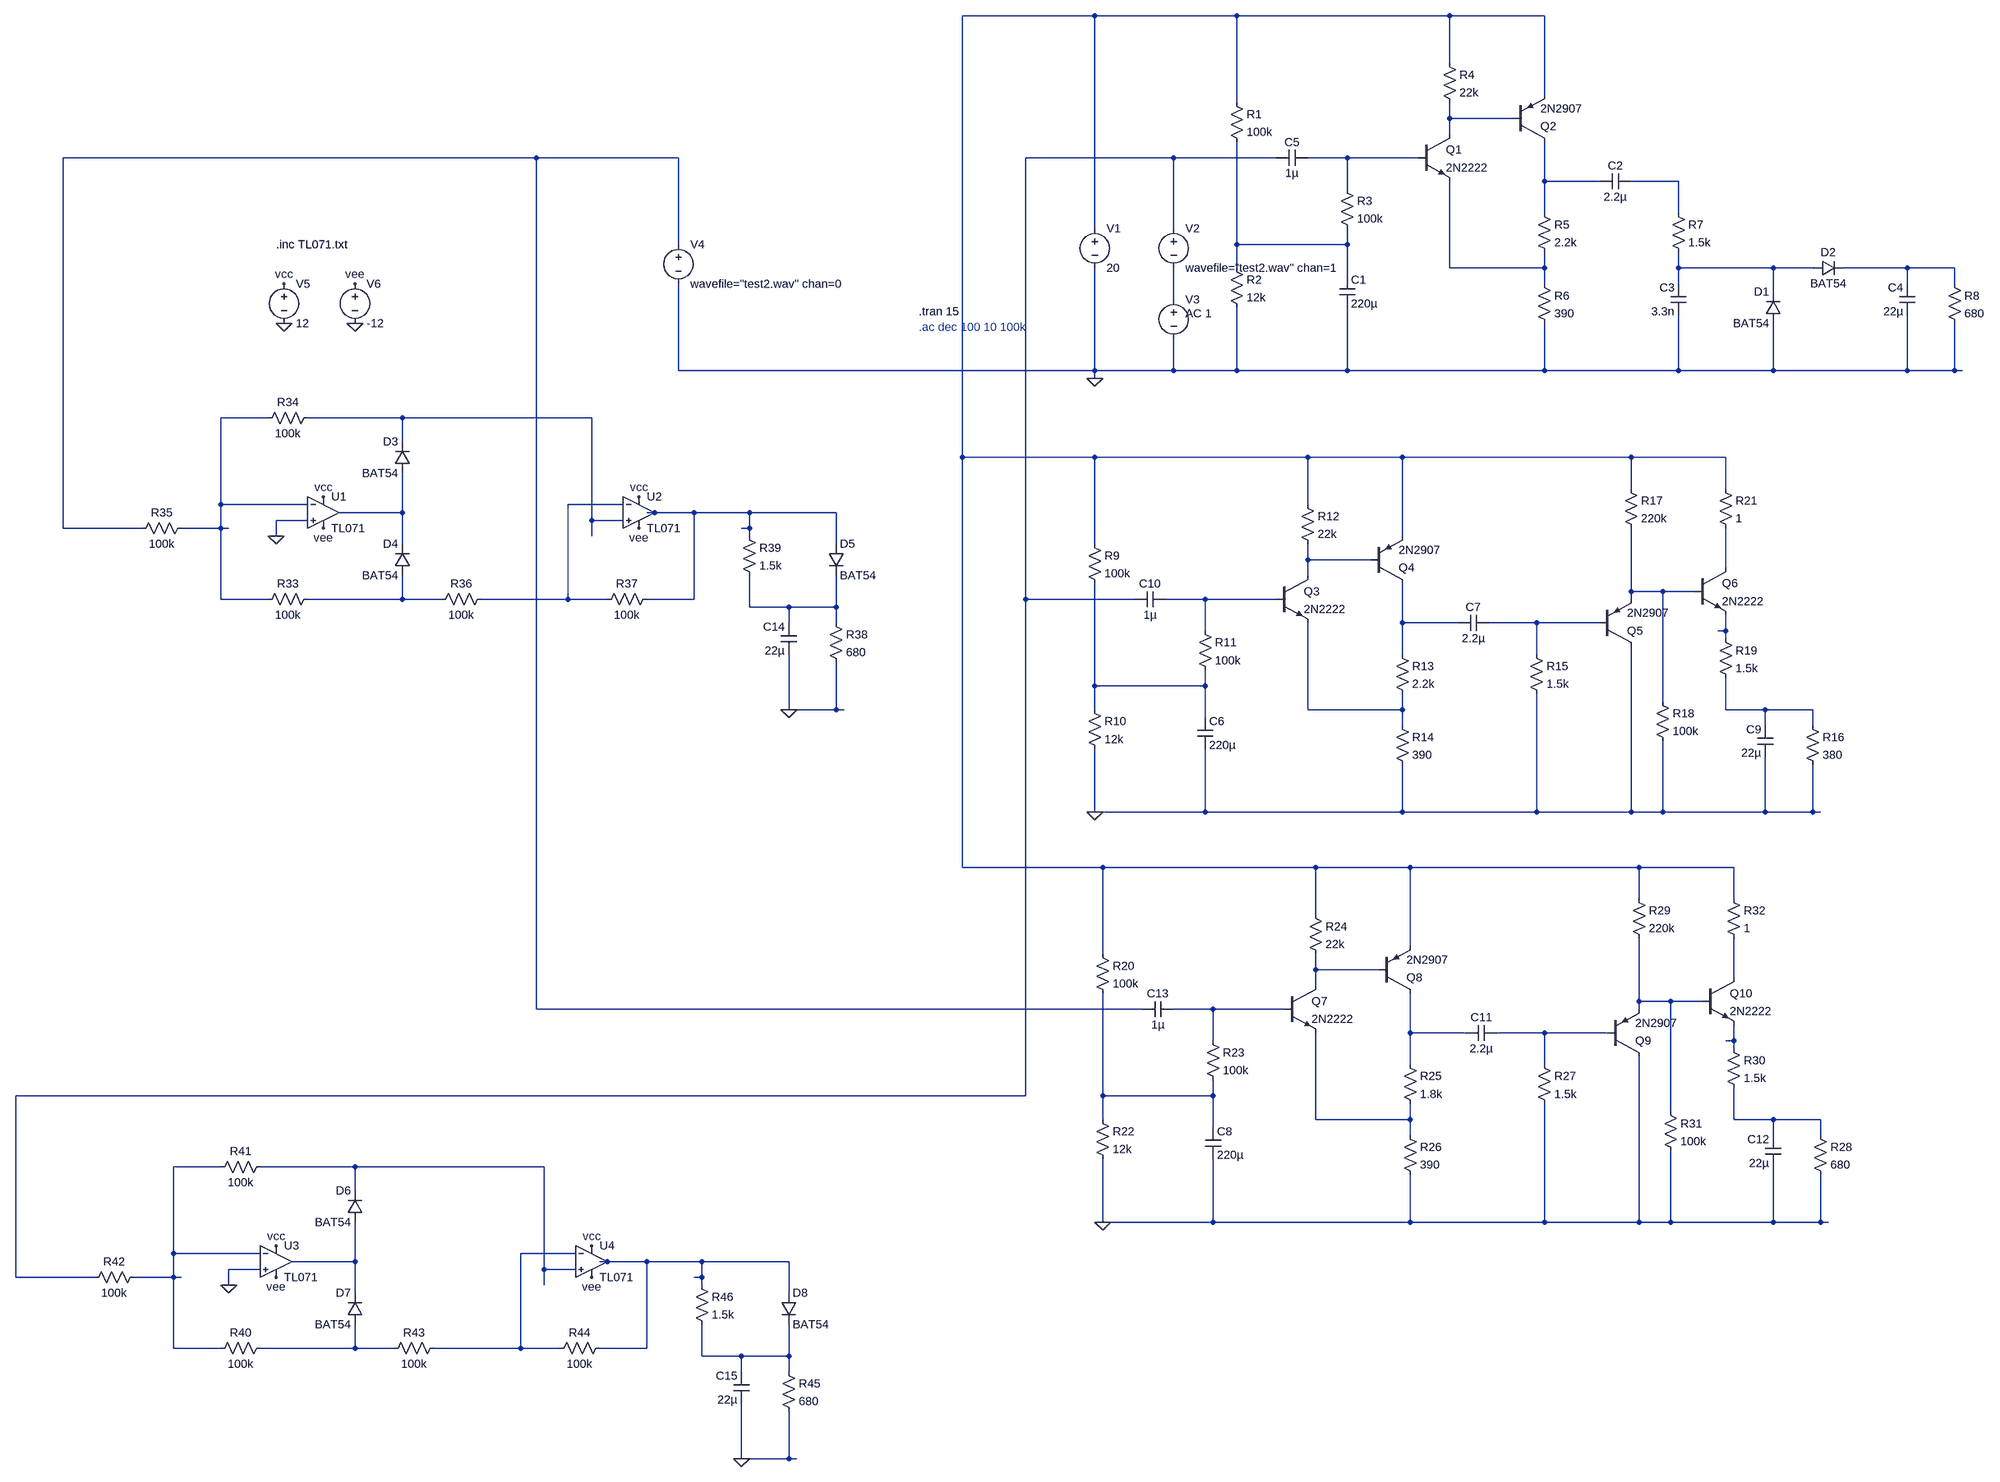
[diagram p0: schematic vumeter.asc]
vumeter.asc, the LTspice schematic file:
Version 4.1
SHEET 1 4276 2852
WIRE -192 -96 -464 -96
WIRE 96 -96 -192 -96
WIRE 528 -96 96 -96
WIRE 720 -96 528 -96
WIRE 528 0 528 -96
WIRE 720 64 720 -96
WIRE 96 80 96 -96
WIRE 528 112 528 80
WIRE 656 112 528 112
WIRE 528 144 528 112
WIRE -1328 192 -2288 192
WIRE -1040 192 -1328 192
WIRE -32 192 -336 192
WIRE 176 192 -32 192
WIRE 320 192 240 192
WIRE 464 192 320 192
WIRE 720 240 720 160
WIRE 832 240 720 240
WIRE 992 240 896 240
WIRE 320 256 320 192
WIRE 720 304 720 240
WIRE 992 304 992 240
WIRE -192 336 -192 -96
WIRE -32 336 -32 192
WIRE -1040 368 -1040 192
WIRE 96 368 96 160
WIRE 320 368 320 336
WIRE 320 368 96 368
WIRE 96 416 96 368
WIRE 528 416 528 240
WIRE 720 416 720 384
WIRE 720 416 528 416
WIRE 992 416 992 384
WIRE 1184 416 992 416
WIRE 1264 416 1184 416
WIRE 1456 416 1328 416
WIRE 1552 416 1456 416
WIRE 320 432 320 368
WIRE 720 448 720 416
WIRE 992 448 992 416
WIRE 1456 448 1456 416
WIRE 1552 448 1552 416
WIRE 1184 464 1184 416
WIRE -32 480 -32 416
WIRE -1040 624 -1040 448
WIRE -192 624 -192 416
WIRE -192 624 -1040 624
WIRE -32 624 -32 560
WIRE -32 624 -192 624
WIRE 96 624 96 496
WIRE 96 624 -32 624
WIRE 320 624 320 496
WIRE 320 624 96 624
WIRE 720 624 720 528
WIRE 720 624 320 624
WIRE 992 624 992 512
WIRE 992 624 720 624
WIRE 1184 624 1184 528
WIRE 1184 624 992 624
WIRE 1456 624 1456 512
WIRE 1456 624 1184 624
WIRE 1552 624 1552 528
WIRE 1552 624 1456 624
WIRE 1568 624 1552 624
WIRE -192 640 -192 624
WIRE -1872 720 -1968 720
WIRE -1600 720 -1792 720
WIRE -1216 720 -1600 720
WIRE -1600 768 -1600 720
WIRE -464 800 -464 -96
WIRE -192 800 -464 800
WIRE 240 800 -192 800
WIRE 432 800 240 800
WIRE 896 800 432 800
WIRE 1088 800 896 800
WIRE 896 864 896 800
WIRE 1088 864 1088 800
WIRE -1968 896 -1968 720
WIRE -1792 896 -1968 896
WIRE -1152 896 -1264 896
WIRE 240 896 240 800
WIRE -1600 912 -1600 832
WIRE -1600 912 -1728 912
WIRE -1088 912 -1104 912
WIRE -1008 912 -1088 912
WIRE -896 912 -1008 912
WIRE -720 912 -896 912
WIRE -1792 928 -1856 928
WIRE -1216 928 -1216 720
WIRE -1152 928 -1216 928
WIRE -2288 944 -2288 192
WIRE -2128 944 -2288 944
WIRE -1968 944 -1968 896
WIRE -1968 944 -2048 944
WIRE -1952 944 -1968 944
WIRE -896 944 -896 912
WIRE -896 944 -912 944
WIRE -1856 960 -1856 928
WIRE -1216 960 -1216 928
WIRE -896 960 -896 944
WIRE 432 960 432 800
WIRE -1600 976 -1600 912
WIRE -720 976 -720 912
WIRE -192 976 -192 800
WIRE 240 1008 240 976
WIRE 368 1008 240 1008
WIRE 1088 1024 1088 944
WIRE 240 1040 240 1008
WIRE 896 1072 896 944
WIRE 960 1072 896 1072
WIRE 1024 1072 960 1072
WIRE -1968 1088 -1968 944
WIRE -1872 1088 -1968 1088
WIRE -1600 1088 -1600 1040
WIRE -1600 1088 -1792 1088
WIRE -1520 1088 -1600 1088
WIRE -1264 1088 -1264 896
WIRE -1264 1088 -1440 1088
WIRE -1184 1088 -1264 1088
WIRE -1008 1088 -1008 912
WIRE -1008 1088 -1104 1088
WIRE -336 1088 -336 192
WIRE -112 1088 -336 1088
WIRE 32 1088 -48 1088
WIRE 176 1088 32 1088
WIRE 896 1088 896 1072
WIRE -896 1104 -896 1040
WIRE -816 1104 -896 1104
WIRE -720 1104 -720 1040
WIRE -720 1104 -816 1104
WIRE -816 1136 -816 1104
WIRE -720 1136 -720 1104
WIRE 432 1136 432 1056
WIRE 544 1136 432 1136
WIRE 704 1136 608 1136
WIRE 832 1136 704 1136
WIRE 32 1152 32 1088
WIRE 1088 1152 1088 1120
WIRE 1088 1152 1072 1152
WIRE 1088 1168 1088 1152
WIRE 432 1200 432 1136
WIRE 704 1200 704 1136
WIRE -192 1264 -192 1056
WIRE 32 1264 32 1232
WIRE 32 1264 -192 1264
WIRE 960 1296 960 1072
WIRE -816 1312 -816 1200
WIRE -720 1312 -720 1216
WIRE -720 1312 -816 1312
WIRE -704 1312 -720 1312
WIRE -192 1312 -192 1264
WIRE 240 1312 240 1136
WIRE 432 1312 432 1280
WIRE 432 1312 240 1312
WIRE 1088 1312 1088 1248
WIRE 1168 1312 1088 1312
WIRE 1264 1312 1168 1312
WIRE 32 1328 32 1264
WIRE 432 1344 432 1312
WIRE 1168 1344 1168 1312
WIRE 1264 1344 1264 1312
WIRE -192 1520 -192 1392
WIRE 32 1520 32 1392
WIRE 32 1520 -192 1520
WIRE 432 1520 432 1424
WIRE 432 1520 32 1520
WIRE 704 1520 704 1280
WIRE 704 1520 432 1520
WIRE 896 1520 896 1184
WIRE 896 1520 704 1520
WIRE 960 1520 960 1376
WIRE 960 1520 896 1520
WIRE 1168 1520 1168 1408
WIRE 1168 1520 960 1520
WIRE 1264 1520 1264 1424
WIRE 1264 1520 1168 1520
WIRE 1280 1520 1264 1520
WIRE -464 1632 -464 800
WIRE -176 1632 -464 1632
WIRE 256 1632 -176 1632
WIRE 448 1632 256 1632
WIRE 912 1632 448 1632
WIRE 1104 1632 912 1632
WIRE 912 1696 912 1632
WIRE 1104 1696 1104 1632
WIRE 256 1728 256 1632
WIRE 448 1792 448 1632
WIRE -176 1808 -176 1632
WIRE 256 1840 256 1808
WIRE 384 1840 256 1840
WIRE 1104 1856 1104 1776
WIRE 256 1872 256 1840
WIRE 912 1904 912 1776
WIRE 976 1904 912 1904
WIRE 1040 1904 976 1904
WIRE -1328 1920 -1328 192
WIRE -96 1920 -1328 1920
WIRE 48 1920 -32 1920
WIRE 192 1920 48 1920
WIRE 912 1920 912 1904
WIRE 448 1968 448 1888
WIRE 560 1968 448 1968
WIRE 720 1968 624 1968
WIRE 848 1968 720 1968
WIRE 48 1984 48 1920
WIRE 1104 1984 1104 1952
WIRE 1104 1984 1088 1984
WIRE 1104 2000 1104 1984
WIRE 448 2032 448 1968
WIRE 720 2032 720 1968
WIRE -336 2096 -336 1088
WIRE -336 2096 -2384 2096
WIRE -176 2096 -176 1888
WIRE 48 2096 48 2064
WIRE 48 2096 -176 2096
WIRE 976 2128 976 1904
WIRE -176 2144 -176 2096
WIRE 256 2144 256 1968
WIRE 448 2144 448 2112
WIRE 448 2144 256 2144
WIRE 1104 2144 1104 2080
WIRE 1184 2144 1104 2144
WIRE 1280 2144 1184 2144
WIRE 48 2160 48 2096
WIRE 448 2176 448 2144
WIRE 1184 2176 1184 2144
WIRE 1280 2176 1280 2144
WIRE -1968 2240 -2064 2240
WIRE -1696 2240 -1888 2240
WIRE -1312 2240 -1696 2240
WIRE -1696 2288 -1696 2240
WIRE -176 2352 -176 2224
WIRE 48 2352 48 2224
WIRE 48 2352 -176 2352
WIRE 448 2352 448 2256
WIRE 448 2352 48 2352
WIRE 720 2352 720 2112
WIRE 720 2352 448 2352
WIRE 912 2352 912 2016
WIRE 912 2352 720 2352
WIRE 976 2352 976 2208
WIRE 976 2352 912 2352
WIRE 1184 2352 1184 2240
WIRE 1184 2352 976 2352
WIRE 1280 2352 1280 2256
WIRE 1280 2352 1184 2352
WIRE 1296 2352 1280 2352
WIRE -2064 2416 -2064 2240
WIRE -1888 2416 -2064 2416
WIRE -1248 2416 -1360 2416
WIRE -1696 2432 -1696 2352
WIRE -1696 2432 -1824 2432
WIRE -1184 2432 -1200 2432
WIRE -1104 2432 -1184 2432
WIRE -992 2432 -1104 2432
WIRE -816 2432 -992 2432
WIRE -1888 2448 -1952 2448
WIRE -1312 2448 -1312 2240
WIRE -1248 2448 -1312 2448
WIRE -2384 2464 -2384 2096
WIRE -2224 2464 -2384 2464
WIRE -2064 2464 -2064 2416
WIRE -2064 2464 -2144 2464
WIRE -2048 2464 -2064 2464
WIRE -992 2464 -992 2432
WIRE -992 2464 -1008 2464
WIRE -1952 2480 -1952 2448
WIRE -1312 2480 -1312 2448
WIRE -992 2480 -992 2464
WIRE -1696 2496 -1696 2432
WIRE -816 2496 -816 2432
WIRE -2064 2608 -2064 2464
WIRE -1968 2608 -2064 2608
WIRE -1696 2608 -1696 2560
WIRE -1696 2608 -1888 2608
WIRE -1616 2608 -1696 2608
WIRE -1360 2608 -1360 2416
WIRE -1360 2608 -1536 2608
WIRE -1280 2608 -1360 2608
WIRE -1104 2608 -1104 2432
WIRE -1104 2608 -1200 2608
WIRE -992 2624 -992 2560
WIRE -912 2624 -992 2624
WIRE -816 2624 -816 2560
WIRE -816 2624 -912 2624
WIRE -912 2656 -912 2624
WIRE -816 2656 -816 2624
WIRE -912 2832 -912 2720
WIRE -816 2832 -816 2736
WIRE -816 2832 -912 2832
WIRE -800 2832 -816 2832
FLAG -192 640 0
FLAG -192 1520 0
FLAG -176 2352 0
FLAG -1840 448 vcc
FLAG -1696 448 vee
FLAG -1840 528 0
FLAG -1696 528 0
FLAG -1760 880 vcc
FLAG -1760 944 vee
FLAG -1856 960 0
FLAG -1120 880 vcc
FLAG -1120 944 vee
FLAG -816 1312 0
FLAG -1856 2400 vcc
FLAG -1856 2464 vee
FLAG -1952 2480 0
FLAG -1216 2400 vcc
FLAG -1216 2464 vee
FLAG -912 2832 0
SYMBOL res 80 64 R0
SYMATTR InstName R1
SYMATTR Value 100k
SYMBOL res 80 400 R0
SYMATTR InstName R2
SYMATTR Value 12k
SYMBOL res 304 240 R0
SYMATTR InstName R3
SYMATTR Value 100k
SYMBOL cap 304 432 R0
SYMATTR InstName C1
SYMATTR Value 220µ
SYMBOL npn 464 144 R0
SYMATTR InstName Q1
SYMATTR Value 2N2222
SYMBOL res 512 -16 R0
SYMATTR InstName R4
SYMATTR Value 22k
SYMBOL res 704 288 R0
SYMATTR InstName R5
SYMATTR Value 2.2k
SYMBOL res 704 432 R0
SYMATTR InstName R6
SYMATTR Value 390
SYMBOL pnp 656 160 M180
SYMATTR InstName Q2
SYMATTR Value 2N2907
SYMBOL cap 896 224 R90
WINDOW 0 0 32 VBottom 2
WINDOW 3 32 32 VTop 2
SYMATTR InstName C2
SYMATTR Value 2.2µ
SYMBOL res 976 288 R0
SYMATTR InstName R7
SYMATTR Value 1.5k
SYMBOL cap 1008 512 R180
WINDOW 0 24 56 Left 2
WINDOW 3 24 8 Left 2
SYMATTR InstName C3
SYMATTR Value 3.3n
SYMBOL diode 1200 528 R180
WINDOW 0 24 64 Left 2
WINDOW 3 24 0 Left 2
SYMATTR InstName D1
SYMATTR Value BAT54
SYMBOL diode 1264 432 R270
WINDOW 0 32 32 VTop 2
WINDOW 3 0 32 VBottom 2
SYMATTR InstName D2
SYMATTR Value BAT54
SYMBOL cap 1472 512 R180
WINDOW 0 24 56 Left 2
WINDOW 3 24 8 Left 2
SYMATTR InstName C4
SYMATTR Value 22µ
SYMBOL res 1536 432 R0
SYMATTR InstName R8
SYMATTR Value 680
SYMBOL cap 240 176 R90
WINDOW 0 0 32 VBottom 2
WINDOW 3 32 32 VTop 2
SYMATTR InstName C5
SYMATTR Value 1µ
SYMBOL voltage -192 320 R0
WINDOW 123 0 0 Left 0
WINDOW 39 0 0 Left 0
SYMATTR InstName V1
SYMATTR Value 20
SYMBOL voltage -32 320 R0
WINDOW 123 0 0 Left 0
WINDOW 39 0 0 Left 0
SYMATTR InstName V2
SYMATTR Value wavefile="test2.wav" chan=1
SYMBOL res -208 960 R0
SYMATTR InstName R9
SYMATTR Value 100k
SYMBOL res -208 1296 R0
SYMATTR InstName R10
SYMATTR Value 12k
SYMBOL res 16 1136 R0
SYMATTR InstName R11
SYMATTR Value 100k
SYMBOL cap 16 1328 R0
SYMATTR InstName C6
SYMATTR Value 220µ
SYMBOL npn 176 1040 R0
SYMATTR InstName Q3
SYMATTR Value 2N2222
SYMBOL res 224 880 R0
SYMATTR InstName R12
SYMATTR Value 22k
SYMBOL res 416 1184 R0
SYMATTR InstName R13
SYMATTR Value 2.2k
SYMBOL res 416 1328 R0
SYMATTR InstName R14
SYMATTR Value 390
SYMBOL pnp 368 1056 M180
SYMATTR InstName Q4
SYMATTR Value 2N2907
SYMBOL cap 608 1120 R90
WINDOW 0 0 32 VBottom 2
WINDOW 3 32 32 VTop 2
SYMATTR InstName C7
SYMATTR Value 2.2µ
SYMBOL res 688 1184 R0
SYMATTR InstName R15
SYMATTR Value 1.5k
SYMBOL cap 1184 1408 R180
WINDOW 0 24 56 Left 2
WINDOW 3 24 8 Left 2
SYMATTR InstName C9
SYMATTR Value 22µ
SYMBOL res 1248 1328 R0
SYMATTR InstName R16
SYMATTR Value 380
SYMBOL cap -48 1072 R90
WINDOW 0 0 32 VBottom 2
WINDOW 3 32 32 VTop 2
SYMATTR InstName C10
SYMATTR Value 1µ
SYMBOL voltage -32 464 R0
WINDOW 123 24 44 Left 2
WINDOW 39 0 0 Left 0
SYMATTR Value2 AC 1
SYMATTR InstName V3
SYMATTR Value ""
SYMBOL pnp 832 1184 M180
SYMATTR InstName Q5
SYMATTR Value 2N2907
SYMBOL npn 1024 1024 R0
SYMATTR InstName Q6
SYMATTR Value 2N2222
SYMBOL res 880 848 R0
SYMATTR InstName R17
SYMATTR Value 220k
SYMBOL res 1072 1152 R0
SYMATTR InstName R19
SYMATTR Value 1.5k
SYMBOL voltage -1040 352 R0
WINDOW 123 0 0 Left 0
WINDOW 39 0 0 Left 0
SYMATTR InstName V4
SYMATTR Value wavefile="test2.wav" chan=0
SYMBOL res 944 1280 R0
SYMATTR InstName R18
SYMATTR Value 100k
SYMBOL res 1072 848 R0
SYMATTR InstName R21
SYMATTR Value 1
SYMBOL res -192 1792 R0
SYMATTR InstName R20
SYMATTR Value 100k
SYMBOL res -192 2128 R0
SYMATTR InstName R22
SYMATTR Value 12k
SYMBOL res 32 1968 R0
SYMATTR InstName R23
SYMATTR Value 100k
SYMBOL cap 32 2160 R0
SYMATTR InstName C8
SYMATTR Value 220µ
SYMBOL npn 192 1872 R0
SYMATTR InstName Q7
SYMATTR Value 2N2222
SYMBOL res 240 1712 R0
SYMATTR InstName R24
SYMATTR Value 22k
SYMBOL res 432 2016 R0
SYMATTR InstName R25
SYMATTR Value 1.8k
SYMBOL res 432 2160 R0
SYMATTR InstName R26
SYMATTR Value 390
SYMBOL pnp 384 1888 M180
SYMATTR InstName Q8
SYMATTR Value 2N2907
SYMBOL cap 624 1952 R90
WINDOW 0 0 32 VBottom 2
WINDOW 3 32 32 VTop 2
SYMATTR InstName C11
SYMATTR Value 2.2µ
SYMBOL res 704 2016 R0
SYMATTR InstName R27
SYMATTR Value 1.5k
SYMBOL cap 1200 2240 R180
WINDOW 0 24 56 Left 2
WINDOW 3 24 8 Left 2
SYMATTR InstName C12
SYMATTR Value 22µ
SYMBOL res 1264 2160 R0
SYMATTR InstName R28
SYMATTR Value 680
SYMBOL cap -32 1904 R90
WINDOW 0 0 32 VBottom 2
WINDOW 3 32 32 VTop 2
SYMATTR InstName C13
SYMATTR Value 1µ
SYMBOL pnp 848 2016 M180
SYMATTR InstName Q9
SYMATTR Value 2N2907
SYMBOL npn 1040 1856 R0
SYMATTR InstName Q10
SYMATTR Value 2N2222
SYMBOL res 896 1680 R0
SYMATTR InstName R29
SYMATTR Value 220k
SYMBOL res 1088 1984 R0
SYMATTR InstName R30
SYMATTR Value 1.5k
SYMBOL res 960 2112 R0
SYMATTR InstName R31
SYMATTR Value 100k
SYMBOL res 1088 1680 R0
SYMATTR InstName R32
SYMATTR Value 1
SYMBOL OpAmps\\opamp2 -1760 848 R0
SYMATTR InstName U1
SYMATTR Value TL071
SYMBOL voltage -1840 432 R0
SYMATTR InstName V5
SYMATTR Value 12
SYMBOL voltage -1696 432 R0
SYMATTR InstName V6
SYMATTR Value -12
SYMBOL diode -1584 832 R180
WINDOW 0 24 64 Left 2
WINDOW 3 24 0 Left 2
SYMATTR InstName D3
SYMATTR Value BAT54
SYMBOL diode -1584 1040 R180
WINDOW 0 24 64 Left 2
WINDOW 3 24 0 Left 2
SYMATTR InstName D4
SYMATTR Value BAT54
SYMBOL res -1776 1072 R90
WINDOW 0 0 56 VBottom 2
WINDOW 3 32 56 VTop 2
SYMATTR InstName R33
SYMATTR Value 100k
SYMBOL res -1776 704 R90
WINDOW 0 0 56 VBottom 2
WINDOW 3 32 56 VTop 2
SYMATTR InstName R34
SYMATTR Value 100k
SYMBOL res -2032 928 R90
WINDOW 0 0 56 VBottom 2
WINDOW 3 32 56 VTop 2
SYMATTR InstName R35
SYMATTR Value 100k
SYMBOL OpAmps\\opamp2 -1120 848 R0
SYMATTR InstName U2
SYMATTR Value TL071
SYMBOL res -1424 1072 R90
WINDOW 0 0 56 VBottom 2
WINDOW 3 32 56 VTop 2
SYMATTR InstName R36
SYMATTR Value 100k
SYMBOL res -1088 1072 R90
WINDOW 0 0 56 VBottom 2
WINDOW 3 32 56 VTop 2
SYMATTR InstName R37
SYMATTR Value 100k
SYMBOL cap -800 1200 R180
WINDOW 0 24 56 Left 2
WINDOW 3 24 8 Left 2
SYMATTR InstName C14
SYMATTR Value 22µ
SYMBOL res -736 1120 R0
SYMATTR InstName R38
SYMATTR Value 680
SYMBOL res -912 944 R0
SYMATTR InstName R39
SYMATTR Value 1.5k
SYMBOL diode -736 976 R0
SYMATTR InstName D5
SYMATTR Value BAT54
SYMBOL OpAmps\\opamp2 -1856 2368 R0
SYMATTR InstName U3
SYMATTR Value TL071
SYMBOL diode -1680 2352 R180
WINDOW 0 24 64 Left 2
WINDOW 3 24 0 Left 2
SYMATTR InstName D6
SYMATTR Value BAT54
SYMBOL diode -1680 2560 R180
WINDOW 0 24 64 Left 2
WINDOW 3 24 0 Left 2
SYMATTR InstName D7
SYMATTR Value BAT54
SYMBOL res -1872 2592 R90
WINDOW 0 0 56 VBottom 2
WINDOW 3 32 56 VTop 2
SYMATTR InstName R40
SYMATTR Value 100k
SYMBOL res -1872 2224 R90
WINDOW 0 0 56 VBottom 2
WINDOW 3 32 56 VTop 2
SYMATTR InstName R41
SYMATTR Value 100k
SYMBOL res -2128 2448 R90
WINDOW 0 0 56 VBottom 2
WINDOW 3 32 56 VTop 2
SYMATTR InstName R42
SYMATTR Value 100k
SYMBOL OpAmps\\opamp2 -1216 2368 R0
SYMATTR InstName U4
SYMATTR Value TL071
SYMBOL res -1520 2592 R90
WINDOW 0 0 56 VBottom 2
WINDOW 3 32 56 VTop 2
SYMATTR InstName R43
SYMATTR Value 100k
SYMBOL res -1184 2592 R90
WINDOW 0 0 56 VBottom 2
WINDOW 3 32 56 VTop 2
SYMATTR InstName R44
SYMATTR Value 100k
SYMBOL cap -896 2720 R180
WINDOW 0 24 56 Left 2
WINDOW 3 24 8 Left 2
SYMATTR InstName C15
SYMATTR Value 22µ
SYMBOL res -832 2640 R0
SYMATTR InstName R45
SYMATTR Value 680
SYMBOL res -1008 2464 R0
SYMATTR InstName R46
SYMATTR Value 1.5k
SYMBOL diode -832 2496 R0
SYMATTR InstName D8
SYMATTR Value BAT54
TEXT -552 504 Left 2 !.tran 15
TEXT -552 536 Left 2 ;.ac dec 100 10 100k
TEXT -1856 368 Left 2 !.inc TL071.txt

The netlist it stands for:
* vumeter.asc
R1 N001 N008 100k
R2 N008 0 12k
R3 N005 N008 100k
C1 N008 0 220µ
Q1 N002 N005 N009 0 2N2222
R4 N001 N002 22k
R5 N006 N009 2.2k
R6 N009 0 390
Q2 N006 N002 N001 0 2N2907
C2 N007 N006 2.2µ
R7 N007 N010 1.5k
C3 0 N010 3.3n
D1 0 N010 BAT54
D2 N010 N011 BAT54
C4 0 N011 22µ
R8 N011 0 680
C5 N005 N004 1µ
V1 N001 0 20
V2 N004 N012 wavefile="test2.wav" chan=1
R9 N001 N027 100k
R10 N027 0 12k
R11 N022 N027 100k
C6 N027 0 220µ
Q3 N018 N022 N028 0 2N2222
R12 N001 N018 22k
R13 N024 N028 2.2k
R14 N028 0 390
Q4 N024 N018 N001 0 2N2907
C7 N025 N024 2.2µ
R15 N025 0 1.5k
C9 0 N029 22µ
R16 N029 0 380
C10 N022 N004 1µ
V3 N012 0 AC 1
Q5 0 N025 N020 0 2N2907
Q6 N019 N020 N026 0 2N2222
R17 N001 N020 220k
R19 N026 N029 1.5k
V4 N003 0 wavefile="test2.wav" chan=0
R18 N020 0 100k
R21 N001 N019 1
R20 N001 N037 100k
R22 N037 0 12k
R23 N033 N037 100k
C8 N037 0 220µ
Q7 N030 N033 N038 0 2N2222
R24 N001 N030 22k
R25 N034 N038 1.8k
R26 N038 0 390
Q8 N034 N030 N001 0 2N2907
C11 N035 N034 2.2µ
R27 N035 0 1.5k
C12 0 N039 22µ
R28 N039 0 680
C13 N033 N003 1µ
Q9 0 N035 N032 0 2N2907
Q10 N031 N032 N036 0 2N2222
R29 N001 N032 220k
R30 N036 N039 1.5k
R31 N032 0 100k
R32 N001 N031 1
X§U1 0 N013 vcc vee N016 TL071  ; pins In+ In- V+ V- OUT
V5 vcc 0 12
V6 vee 0 -12
D3 N016 N014 BAT54
D4 N021 N016 BAT54
R33 N021 N013 100k
R34 N014 N013 100k
R35 N013 N003 100k
X§U2 N014 N015 vcc vee N017 TL071  ; pins In+ In- V+ V- OUT
R36 N015 N021 100k
R37 N017 N015 100k
C14 0 N023 22µ
R38 N023 0 680
R39 N017 N023 1.5k
D5 N017 N023 BAT54
X§U3 0 N040 vcc vee N043 TL071  ; pins In+ In- V+ V- OUT
D6 N043 N041 BAT54
D7 N045 N043 BAT54
R40 N045 N040 100k
R41 N041 N040 100k
R42 N040 N004 100k
X§U4 N041 N042 vcc vee N044 TL071  ; pins In+ In- V+ V- OUT
R43 N042 N045 100k
R44 N044 N042 100k
C15 0 N046 22µ
R45 N046 0 680
R46 N044 N046 1.5k
D8 N044 N046 BAT54
.model D D
.lib standard.dio
.model NPN NPN
.model PNP PNP
.lib standard.bjt
.tran 15
* .ac dec 100 10 100k
.inc TL071.txt
.backanno
.end